# EAGLE design DS18B20_Modbus_v0.1 (EAGLE 7.7.0)
Assembly variants: default
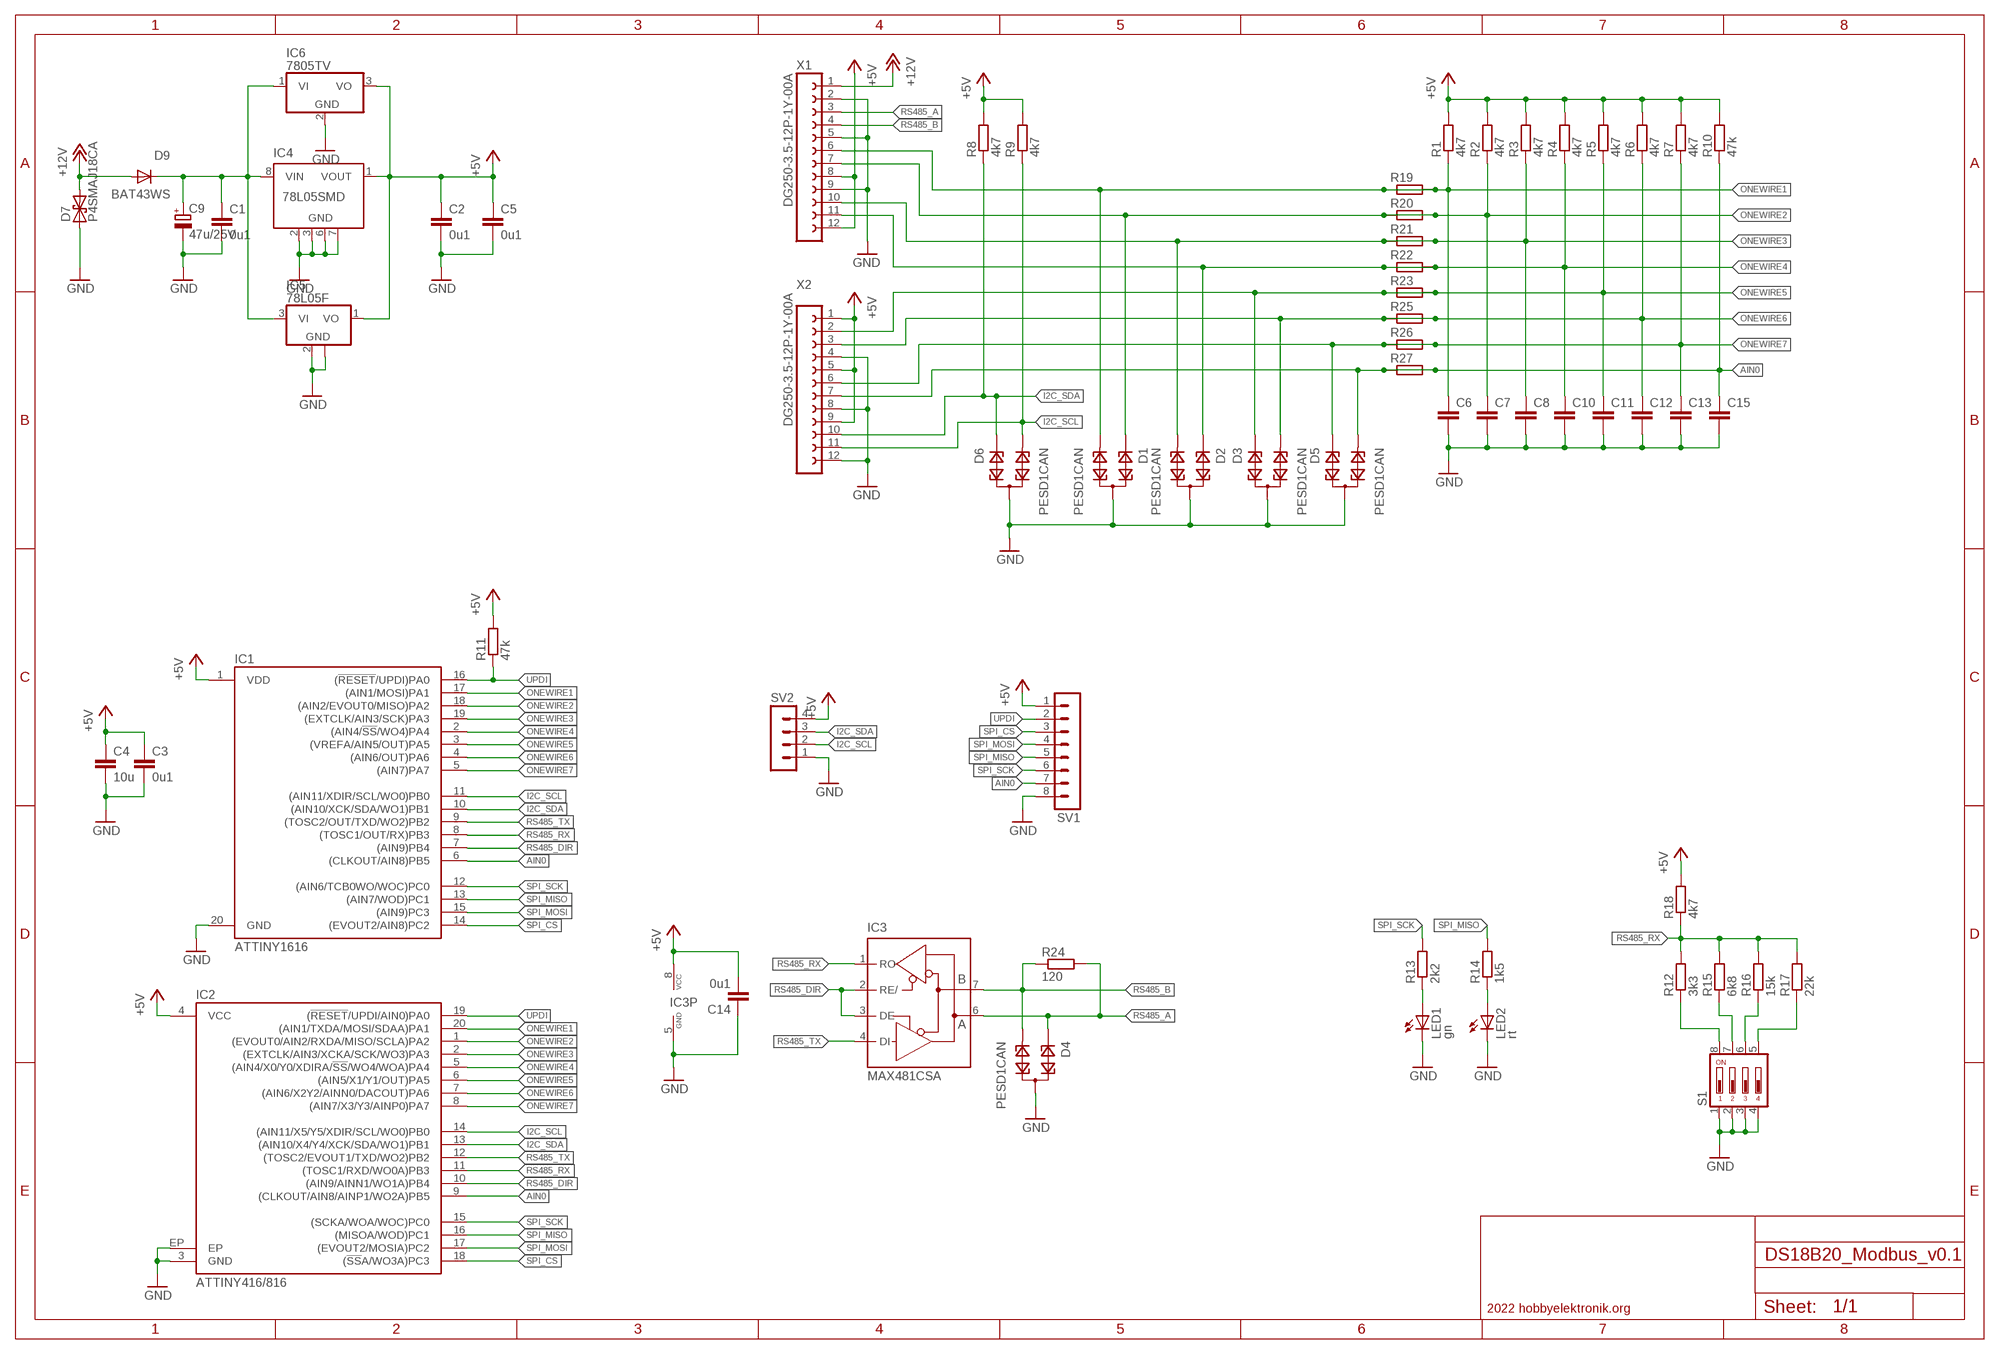
[diagram p0: schematic, sheet 1]

## Parts
C1  0u1  C-EUC0805  [C0805]
C2  0u1  C-EUC0603  [C0603]
C3  0u1  C-EUC0603  [C0603]
C4  10u  C-EUC0805  [C0805]
C5  0u1  C-EUC0603  [C0603]
C6  C-EUC0603  [C0603]  (not fitted in variant default)
C7  C-EUC0603  [C0603]  (not fitted in variant default)
C8  C-EUC0603  [C0603]  (not fitted in variant default)
C9  47u/25V  CPOL-EUE2.5-5  [E2,5-5]
C10  C-EUC0603  [C0603]  (not fitted in variant default)
C11  C-EUC0603  [C0603]  (not fitted in variant default)
C12  C-EUC0603  [C0603]  (not fitted in variant default)
C13  C-EUC0603  [C0603]  (not fitted in variant default)
C14  0u1  C-EUC0603  [C0603]
C15  C-EUC0603  [C0603]  (not fitted in variant default)
D1  PESD1CAN  [SOT23]
D2  PESD1CAN  [SOT23]
D3  PESD1CAN  [SOT23]
D4  PESD1CAN  [SOT23]
D5  PESD1CAN  [SOT23]
D6  PESD1CAN  [SOT23]
D7  P4SMAJ18CA  P4SMAJ10CA  [DO214AC]
D9  BAT43WS  DIODE-SOD323-W  [SOD323-W]
IC1  ATTINY1616  [SO20_T1616]
IC2  ATTINY416/816  [ZCL_VQFN-20]  (not fitted in variant default)
IC3  MAX481CSA  [SO08]
IC4  78L05SMD  [SO08]  (not fitted in variant default)
IC5  78L05F  [SOT89]
IC6  7805TV  [TO220V]  (not fitted in variant default)
LED1  gn  LEDSML0805  [SML0805]
LED2  rt  LEDSML0805  [SML0805]
R1  4k7  R-EU_R0603  [R0603]
R2  4k7  R-EU_R0603  [R0603]
R3  4k7  R-EU_R0603  [R0603]
R4  4k7  R-EU_R0603  [R0603]
R5  4k7  R-EU_R0603  [R0603]
R6  4k7  R-EU_R0603  [R0603]
R7  4k7  R-EU_R0603  [R0603]
R8  4k7  R-EU_R0603  [R0603]
R9  4k7  R-EU_R0603  [R0603]
R10  47k  R-EU_R0603  [R0603]
R11  47k  R-EU_R0603  [R0603]
R12  3k3  R-EU_R0603  [R0603]  (not fitted in variant default)
R13  2k2  R-EU_R0603  [R0603]
R14  1k5  R-EU_R0603  [R0603]
R15  6k8  R-EU_R0603  [R0603]  (not fitted in variant default)
R16  15k  R-EU_R0603  [R0603]  (not fitted in variant default)
R17  22k  R-EU_R0603  [R0603]  (not fitted in variant default)
R18  4k7  R-EU_R0603  [R0603]
R19  R-EU_R0603  [R0603]  (not fitted in variant default)
R20  R-EU_R0603  [R0603]  (not fitted in variant default)
R21  R-EU_R0603  [R0603]  (not fitted in variant default)
R22  R-EU_R0603  [R0603]  (not fitted in variant default)
R23  R-EU_R0603  [R0603]  (not fitted in variant default)
R24  120  R-EU_R0603  [R0603]
R25  R-EU_R0603  [R0603]  (not fitted in variant default)
R26  R-EU_R0603  [R0603]  (not fitted in variant default)
R27  R-EU_R0603  [R0603]  (not fitted in variant default)
S1  DS04  [DS-04]  (not fitted in variant default)
SV1  MA08-1R  [MA08-1R]
SV2  MA04-1R  [MA04-1R]
X1  DG250-3.5-12P-1Y-00A  [DG250-3.5-12P-1Y-00A]
X2  DG250-3.5-12P-1Y-00A  [DG250-3.5-12P-1Y-00A]

## Nets
+5V: C2.1 C3.1 C4.1 C5.1 C14.2 IC1.1(VDD) IC2.4(VCC) IC3.8(VCC) IC4.1(VOUT) IC5.1(VO) IC6.3(VO) R1.2 R2.2 R3.2 R4.2 R5.2 R6.2 R7.2 R8.2 R9.2 R10.2 R11.2 R18.2 SV1.1 SV2.4 X1.8 X1.12 X2.1 X2.5 X2.9
+12V: D7.2 D9.A X1.1
AIN0: C15.1 D5.2 IC1.6((CLKOUT/AIN8)PB5) IC2.9((CLKOUT/AIN8/AINP1/WO2A)PB5) R10.1 R27.1 R27.2 SV1.7 X2.7
GND: C1.2 C2.2 C3.2 C4.2 C5.2 C6.2 C7.2 C8.2 C9.- C10.2 C11.2 C12.2 C13.2 C14.1 C15.2 D1.3 D2.3 D3.3 D4.3 D5.3 D6.3 D7.1 IC1.20(GND) IC2.3(GND) IC2.EP IC3.5(GND) IC4.2(GND) IC4.3(GND) IC4.6(GND) IC4.7(GND) IC5.2(GND) IC5.2@1(GND) IC6.2(GND) LED1.C LED2.C S1.1 S1.2 S1.3 S1.4 SV1.8 SV2.1 X1.2 X1.5 X1.9 X2.4 X2.8 X2.12
I2C_SCL: D6.2 IC1.11((AIN11/XDIR/SCL/WO0)PB0) IC2.14((AIN11/X5/Y5/XDIR/SCL/WO0)PB0) R9.1 SV2.2 X2.11
I2C_SDA: D6.1 IC1.10((AIN10/XCK/SDA/WO1)PB1) IC2.13((AIN10/X4/Y4/XCK/SDA/WO1)PB1) R8.1 SV2.3 X2.10
N$2: R12.1 S1.8
N$3: R15.1 S1.7
N$4: R16.1 S1.6
N$5: R17.1 S1.5
N$6: LED1.A R13.1
N$7: LED2.A R14.1
N$9: C1.1 C9.+ D9.C IC4.8(VIN) IC5.3(VI) IC6.1(VI)
ONEWIRE1: C6.1 D1.2 IC1.17((AIN1/MOSI)PA1) IC2.20((AIN1/TXDA/MOSI/SDAA)PA1) R1.1 R19.1 R19.2 X1.6
ONEWIRE2: C7.1 D1.1 IC1.18((AIN2/EVOUT0/MISO)PA2) IC2.1((EVOUT0/AIN2/RXDA/MISO/SCLA)PA2) R2.1 R20.1 R20.2 X1.7
ONEWIRE3: C8.1 D2.2 IC1.19((EXTCLK/AIN3/SCK)PA3) IC2.2((EXTCLK/AIN3/XCKA/SCK/WO3)PA3) R3.1 R21.1 R21.2 X1.10
ONEWIRE4: C10.1 D2.1 IC1.2((AIN4/!SS!/WO4)PA4) IC2.5((AIN4/X0/Y0/XDIRA/!SS!/WO4/WOA)PA4) R4.1 R22.1 R22.2 X1.11
ONEWIRE5: C11.1 D3.1 IC1.3((VREFA/AIN5/OUT)PA5) IC2.6((AIN5/X1/Y1/OUT)PA5) R5.1 R23.1 R23.2 X2.2
ONEWIRE6: C12.1 D3.2 IC1.4((AIN6/OUT)PA6) IC2.7((AIN6/X2Y2/AINN0/DACOUT)PA6) R6.1 R25.1 R25.2 X2.3
ONEWIRE7: C13.1 D5.1 IC1.5((AIN7)PA7) IC2.8((AIN7/X3/Y3/AINP0)PA7) R7.1 R26.1 R26.2 X2.6
RS485_A: D4.1 IC3.6(A) R24.2 X1.3
RS485_B: D4.2 IC3.7(B) R24.1 X1.4
RS485_DIR: IC1.7((AIN9)PB4) IC2.10((AIN9/AINN1/WO1A)PB4) IC3.2(RE/) IC3.3(DE)
RS485_RX: IC1.8((TOSC1/OUT/RX)PB3) IC2.11((TOSC1/RXD/WO0A)PB3) IC3.1(RO) R12.2 R15.2 R16.2 R17.2 R18.1
RS485_TX: IC1.9((TOSC2/OUT/TXD/WO2)PB2) IC2.12((TOSC2/EVOUT1/TXD/WO2)PB2) IC3.4(DI)
SPI_CS: IC1.14((EVOUT2/AIN8)PC2) IC2.18((!SS!A/WO3A)PC3) SV1.3
SPI_MISO: IC1.13((AIN7/WOD)PC1) IC2.16((MISOA/WOD)PC1) R14.2 SV1.5
SPI_MOSI: IC1.15((AIN9)PC3) IC2.17((EVOUT2/MOSIA)PC2) SV1.4
SPI_SCK: IC1.12((AIN6/TCB0WO/WOC)PC0) IC2.15((SCKA/WOA/WOC)PC0) R13.2 SV1.6
UPDI: IC1.16((!RESET!/UPDI)PA0) IC2.19((!RESET!/UPDI/AIN0)PA0) R11.1 SV1.2
Unconnected: IC4.4(NC) IC4.5(NC)

## Notes on the sheet
- 2022 hobbyelektronik.org

## Library data of the parts
C1 = rcl:C-EU: CAPACITOR, European symbol; OC_REICHELT: KEM X7R0805 100N
C2 C3 C5 C14 = rcl:C-EU: CAPACITOR, European symbol; OC_REICHELT: KEM Y5V0603 100N
C4 = rcl:C-EU: CAPACITOR, European symbol; OC_REICHELT: KEM X5R0805 10U
C6-C8 C10-C13 C15 = rcl:C-EU: CAPACITOR, European symbol
C9 = rcl:CPOL-EU: POLARIZED CAPACITOR, European symbol; OC_REICHELT: HD-A 47U 25
D1-D6 = diode:PESD1CAN: CAN bus ESD protection diode Source: http://www.nxp.com/documents/data_sheet/PESD1CAN.pdf; OC_REICHELT: PESD 1CAN
D7 = diode-diotec:P4SMAJ; OC_REICHELT: P4SMAJ18CA
D9 = diode:DIODE-: DIODE; OC_REICHELT: BAT 43WS
IC1 = avr-7:ATTINY1616; OC_REICHELT: ATTINY1616-SN
IC2 = avr-7:ATTINY416/816
IC3 = maxim:MAX481CSA: RS485 TRANSEIVER; MF: MAXIM; MPN: MAX481CSA; OC_FARNELL: unknown; OC_NEWARK: 90C3817; OC_REICHELT: MAX 481 CSA
IC4 = linear:78L*SMD: Positive VOLTAGE REGULATOR
IC5 = linear:78L*: POSITOIV-VOLTAGE REGULATORS Output up to 100 mA Source: Datasheet <http://focus.ti.com/lit/ds/symlink/ua78l05.pdf>; OC_REICHELT: TS 78L05 ACY
IC6 = linear:78*: Positive VOLTAGE REGULATOR Source: http://cache.national.com/ds/LM/LM78L05.pdf http://www.fairchildsemi.com/ds/LM/LM7805.pdf
LED1 = led:LED: LED OSRAM: - CHIPLED LG R971, LG N971, LY N971, LG Q971, LY Q971, LO R971, LY R971 LH N974, LH R974 LS Q976, LO Q976, LY Q976 LO Q996 - Hyper CHIPLED LW Q18S LB Q993, LB Q99A, LB R99A - SideLED LS A670, LO A670, LY A670, LG A670, LP A670 LB A673, LV A673, LT A673, LW A673 LH A674 LY A675 LS A676, LA A676, LO A676, LY A676, LW A676 LS A679, LY A679, LG A679 - Hyper Micro SIDELED® LS Y876, LA Y876, LO Y876, LY Y876 LT Y87S - SmartLED LW L88C, LW L88S LB L89C, LB L89S, LG L890 LS L89K, LO L89K, LY L89K LS L896, LA L896, LO L896, LY L896 - TOPLED LS T670, LO T670, LY T670, LG T670, LP T670 LSG T670, LSP T670, LSY T670, LOP T670, LYG T670 LG T671, LOG T671, LSG T671 LB T673, LV T673, LT T673, LW T673 LH T674 LS T676, LA T676, LO T676, LY T676, LB T676, LH T676, LSB T676, LW T676 LB T67C, LV T67C, LT T67C, LS T67K, LO T67K, LY T67K, LW E67C LS E67B, LA E67B, LO E67B, LY E67B, LB E67C, LV E67C, LT E67C LW T67C LS T679, LY T679, LG T679 LS T770, LO T770, LY T770, LG T770, LP T770 LB T773, LV T773, LT T773, LW T773 LH T774 LS E675, LA E675, LY E675, LS T675 LS T776, LA T776, LO T776, LY T776, LB T776 LHGB T686 LT T68C, LB T68C - Hyper Mini TOPLED® LB M676 - Mini TOPLED Santana® LG M470 LS M47K, LO M47K, LY M47K Source: http://www.osram.convergy.de LUXEON: - LUMILED® LXK2-PW12-R00, LXK2-PW12-S00, LXK2-PW14-U00, LXK2-PW14-V00 LXK2-PM12-R00, LXK2-PM12-S00, LXK2-PM14-U00 LXK2-PE12-Q00, LXK2-PE12-R00, LXK2-PE12-S00, LXK2-PE14-T00, LXK2-PE14-U00 LXK2-PB12-K00, LXK2-PB12-L00, LXK2-PB12-M00, LXK2-PB14-N00, LXK2-PB14-P00, LXK2-PB14-Q00 LXK2-PR12-L00, LXK2-PR12-M00, LXK2-PR14-Q00, LXK2-PR14-R00 LXK2-PD12-Q00, LXK2-PD12-R00, LXK2-PD12-S00 LXK2-PH12-R00, LXK2-PH12-S00 LXK2-PL12-P00, LXK2-PL12-Q00, LXK2-PL12-R00 Source: www.luxeon.com KINGBRIGHT: KA-3528ASYC Source: www.kingbright.com; OC_REICHELT: SMD-LED 0805 GN
LED2 = led:LED: LED OSRAM: - CHIPLED LG R971, LG N971, LY N971, LG Q971, LY Q971, LO R971, LY R971 LH N974, LH R974 LS Q976, LO Q976, LY Q976 LO Q996 - Hyper CHIPLED LW Q18S LB Q993, LB Q99A, LB R99A - SideLED LS A670, LO A670, LY A670, LG A670, LP A670 LB A673, LV A673, LT A673, LW A673 LH A674 LY A675 LS A676, LA A676, LO A676, LY A676, LW A676 LS A679, LY A679, LG A679 - Hyper Micro SIDELED® LS Y876, LA Y876, LO Y876, LY Y876 LT Y87S - SmartLED LW L88C, LW L88S LB L89C, LB L89S, LG L890 LS L89K, LO L89K, LY L89K LS L896, LA L896, LO L896, LY L896 - TOPLED LS T670, LO T670, LY T670, LG T670, LP T670 LSG T670, LSP T670, LSY T670, LOP T670, LYG T670 LG T671, LOG T671, LSG T671 LB T673, LV T673, LT T673, LW T673 LH T674 LS T676, LA T676, LO T676, LY T676, LB T676, LH T676, LSB T676, LW T676 LB T67C, LV T67C, LT T67C, LS T67K, LO T67K, LY T67K, LW E67C LS E67B, LA E67B, LO E67B, LY E67B, LB E67C, LV E67C, LT E67C LW T67C LS T679, LY T679, LG T679 LS T770, LO T770, LY T770, LG T770, LP T770 LB T773, LV T773, LT T773, LW T773 LH T774 LS E675, LA E675, LY E675, LS T675 LS T776, LA T776, LO T776, LY T776, LB T776 LHGB T686 LT T68C, LB T68C - Hyper Mini TOPLED® LB M676 - Mini TOPLED Santana® LG M470 LS M47K, LO M47K, LY M47K Source: http://www.osram.convergy.de LUXEON: - LUMILED® LXK2-PW12-R00, LXK2-PW12-S00, LXK2-PW14-U00, LXK2-PW14-V00 LXK2-PM12-R00, LXK2-PM12-S00, LXK2-PM14-U00 LXK2-PE12-Q00, LXK2-PE12-R00, LXK2-PE12-S00, LXK2-PE14-T00, LXK2-PE14-U00 LXK2-PB12-K00, LXK2-PB12-L00, LXK2-PB12-M00, LXK2-PB14-N00, LXK2-PB14-P00, LXK2-PB14-Q00 LXK2-PR12-L00, LXK2-PR12-M00, LXK2-PR14-Q00, LXK2-PR14-R00 LXK2-PD12-Q00, LXK2-PD12-R00, LXK2-PD12-S00 LXK2-PH12-R00, LXK2-PH12-S00 LXK2-PL12-P00, LXK2-PL12-Q00, LXK2-PL12-R00 Source: www.luxeon.com KINGBRIGHT: KA-3528ASYC Source: www.kingbright.com; OC_REICHELT: SMD-LED 0805 RT
R1-R8 R18 = rcl:R-EU_: RESISTOR, European symbol; OC_REICHELT: SMD-0603 4,7K
R9-R11 = rcl:R-EU_: RESISTOR, European symbol; OC_REICHELT: SMD-0603 47K
R12 R15-R17 R19-R23 R25-R27 = rcl:R-EU_: RESISTOR, European symbol
R13 = rcl:R-EU_: RESISTOR, European symbol; OC_REICHELT: SMD-0603 2,2K
R14 = rcl:R-EU_: RESISTOR, European symbol; OC_REICHELT: SMD-0603 1,5K
R24 = rcl:R-EU_: RESISTOR, European symbol; OC_REICHELT: RND 155HP03 AL
S1 = switch-dil:DS04: DIL/CODE SWITCH; OC_FARNELL: 9471570; OC_NEWARK: unknown
SV1 = con-lstb:MA08-1: PIN HEADER; OC_REICHELT: MPE 087-1-008
SV2 = con-lstb:MA04-1: PIN HEADER; OC_REICHELT: MPE 087-1-004
X1 X2 = con-degson:DG250-3.5-12P-1Y-00A; OC_REICHELT: DG250 3,5-12

## Board
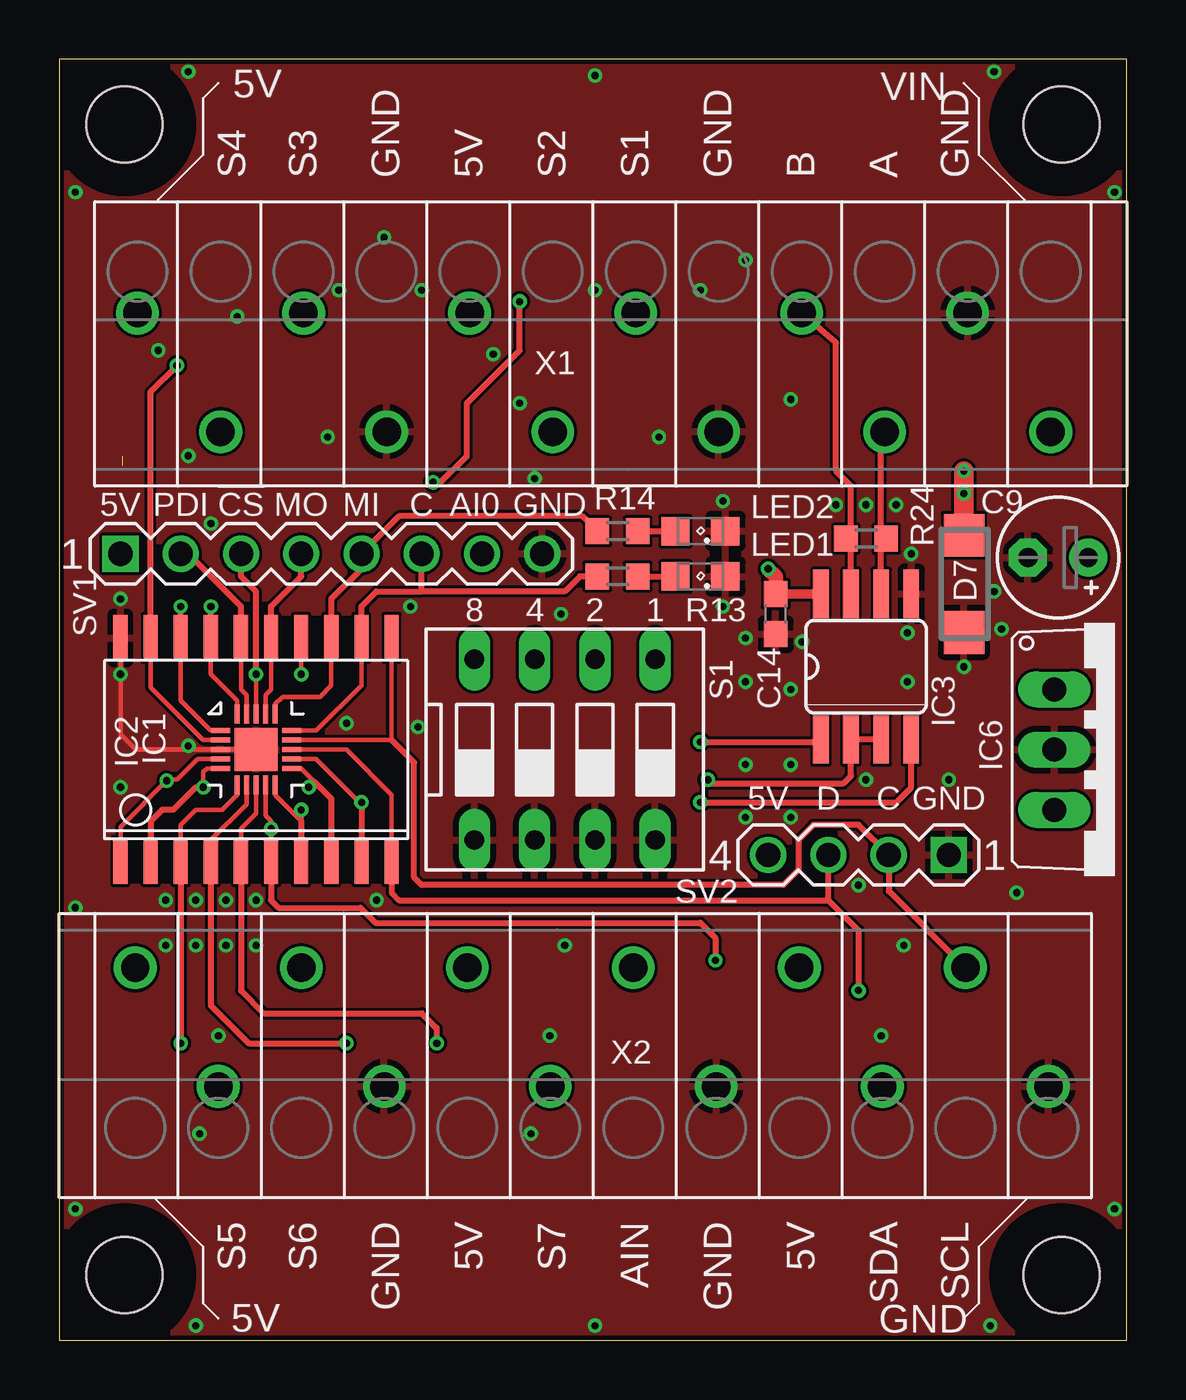
[diagram p1: board, top side]
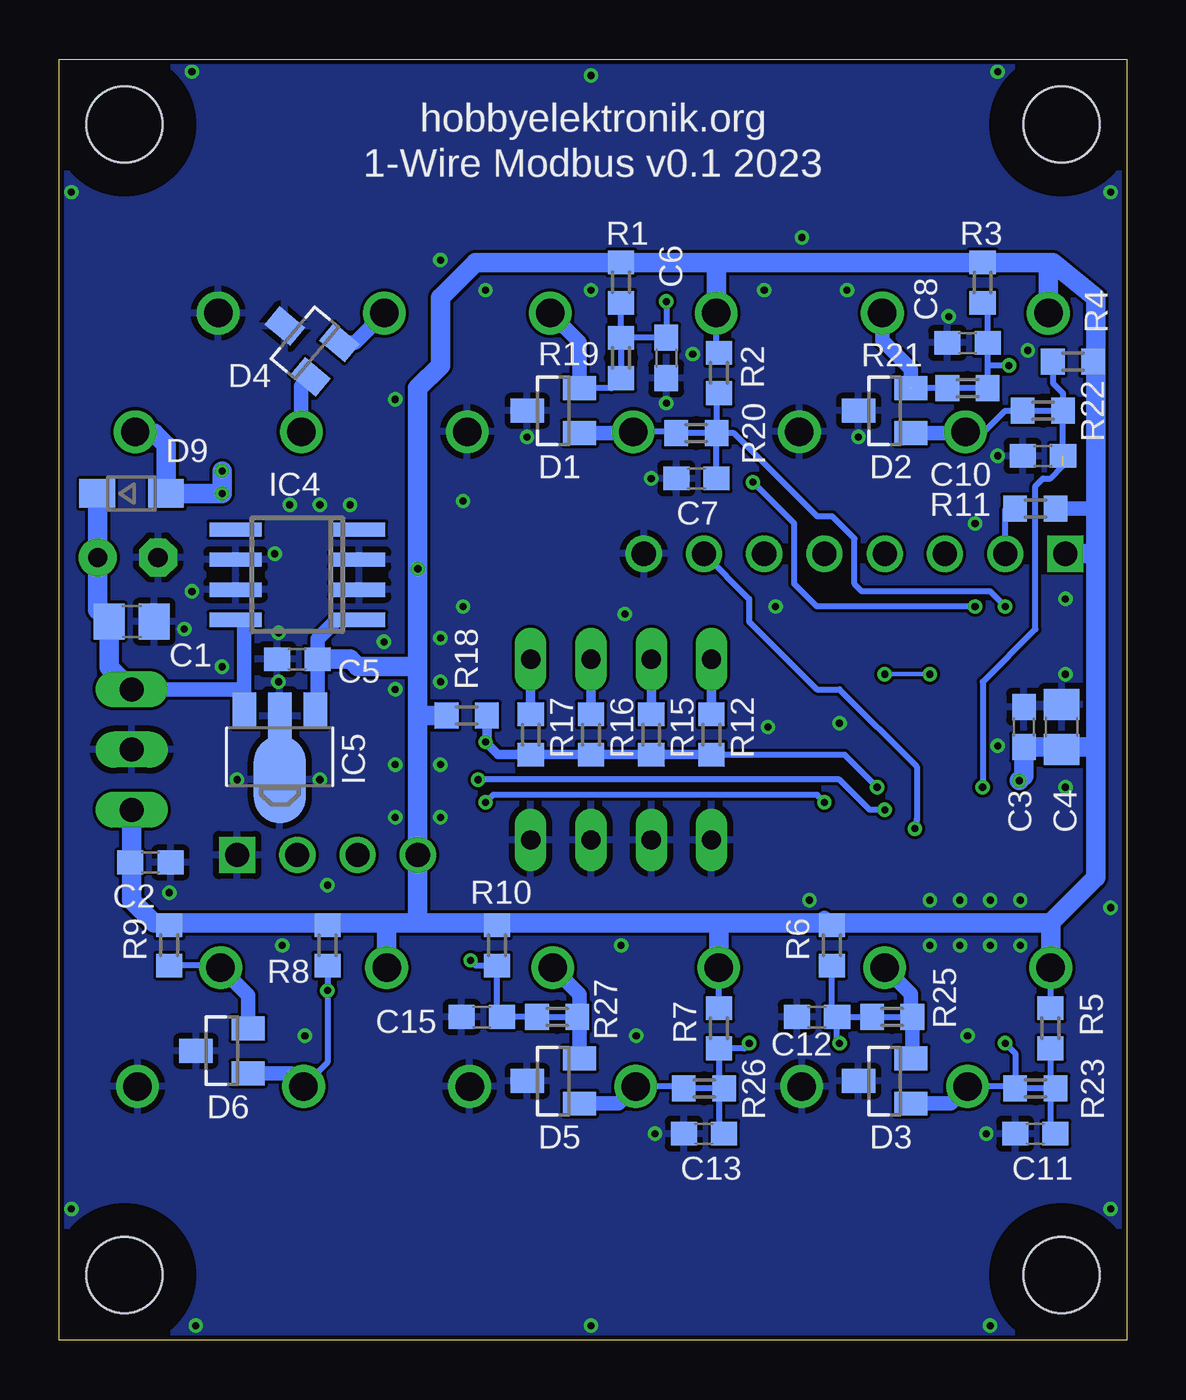
[diagram p2: board, bottom side, seen from below]

Size 45 x 54 mm. Coordinates in mm from the lower left corner, seen from the top.
Outline: 0,0 45,0 45,54 0,54 0,0
Copper layers (1*16): Top 0.035mm / dielectric 1.5mm / Bottom 0.035mm
Design rules "jlcpcb_2L": minimum track width 5mil, minimum drill 0.3mm, track to track 5mil, track to pad 5mil, pad to pad 0.2mm, via to via 0.25mm, smd to smd 0mil, copper to edge 0.2mm, drill to drill 0.5mm, minimum pad ring 10mil, minimum via ring 6mil, stop-mask expansion 2mil, vias tented up to drill 25mil, thermal gap 10mil
Holes 3.2 mm at 42.25,2.75 2.75,2.75 42.25,51.25 2.75,51.25
tRestrict: area 0,0 to 5.5,5.5; area 0,48.5 to 5.5,54; area 39.5,48.5 to 45,54; area 39.5,0 to 45,5.5; 12 lines
bRestrict: area 0,48.5 to 5.5,54; area 39.5,48.5 to 45,54; area 39.5,0 to 45,5.5; area 0,0 to 5.5,5.5; 16 lines

### Footprints (pad centres in the part's own frame; a part is rotated, then mirrored left to right if it is on the bottom)
C0805 = smd 1.3 x 1.5: 1 -0.95,0; 2 0.95,0
C0603 = smd 1.1 x 1: 1 -0.85,0; 2 0.85,0
E2,5-5 = drill 0.813 pad 1.6: + -1.27,0 | drill 0.813 pad 1.6 octagon: - 1.27,0
SOT23 = smd 1 x 1.4: 1 -0.95,-1.1; 2 0.95,-1.1; 3 0,1.1
DO214AC = smd 1.8 x 1.7: 1 2.05,0; 2 -2.05,0
SOD323-W = smd 1.5 x 1.2: A 1.45,0; C -1.45,0
SO20_T1616 = smd 0.6 x 1.95: 1 -5.715,-4.7; 2 -4.445,-4.7; 3 -3.175,-4.7; 4 -1.905,-4.7; 5 -0.635,-4.7; 6 0.635,-4.7; 7 1.905,-4.7; 8 3.175,-4.7; 9 4.445,-4.7; 10 5.715,-4.7; 11 5.715,4.7; 12 4.445,4.7; 13 3.175,4.7; 14 1.905,4.7; 15 0.635,4.7; 16 -0.635,4.7; 17 -1.905,4.7; 18 -3.175,4.7; 19 -4.445,4.7; 20 -5.715,4.7
ZCL_VQFN-20 = smd 0.8 x 0.2: 1 -1.5,0.8; 2 -1.5,0.4; 3 -1.5,0; 4 -1.5,-0.4; 5 -1.5,-0.8; 11 1.5,-0.8; 12 1.5,-0.4; 13 1.5,0; 14 1.5,0.4; 15 1.5,0.8 | smd 0.2 x 0.8: 6 -0.8,-1.5; 7 -0.4,-1.5; 8 0,-1.5; 9 0.4,-1.5; 10 0.8,-1.5; 16 0.8,1.5; 17 0.4,1.5; 18 0,1.5; 19 -0.4,1.5; 20 -0.8,1.5 | smd 1.8 x 1.8: EP 0,0
SO08 = smd 0.66 x 2.032: 1 -1.905,-3.073; 2 -0.635,-3.073; 3 0.635,-3.073; 4 1.905,-3.073; 5 1.905,3.073; 6 0.635,3.073; 7 -0.635,3.073; 8 -1.905,3.073
SO08' = smd 0.6 x 2.2: 1 -1.905,-2.6; 2 -0.635,-2.6; 3 0.635,-2.6; 4 1.905,-2.6; 5 1.905,2.6; 6 0.635,2.6; 7 -0.635,2.6; 8 -1.905,2.6
SOT89 = smd 1 x 1.5: 1 -1.499,-1.981; 3 1.499,-1.981 | smd 1 x 2: 2 0,-1.727 | smd 2.2 x 3.7: 2@1 0,0.94
TO220V = drill 1.016 long: 1 -2.54,-2.54; 2 0,-2.54; 3 2.54,-2.54
SML0805 = smd 1.2 x 1.2: A 1.05,0; C -1.05,0
R0603 = smd 1 x 1.1: 1 -0.85,0; 2 0.85,0
DS-04 = drill 0.813 long: 1 -3.81,-3.81; 2 -1.27,-3.81; 3 1.27,-3.81; 4 3.81,-3.81; 5 3.81,3.81; 6 1.27,3.81; 7 -1.27,3.81; 8 -3.81,3.81
MA08-1R = drill 1.016 square: 1 -8.89,0 | drill 1.016: 2 -6.35,0; 3 -3.81,0; 4 -1.27,0; 5 1.27,0; 6 3.81,0; 7 6.35,0; 8 8.89,0
MA04-1R = drill 1.016 square: 1 -3.81,0 | drill 1.016: 2 -1.27,0; 3 1.27,0; 4 3.81,0
DG250-3.5-12P-1Y-00A = drill 1.2: 1 -19.3,3.7; 2 -15.8,-1.3; 3 -12.3,3.7; 4 -8.8,-1.3; 5 -5.3,3.7; 6 -1.8,-1.3; 7 1.7,3.7; 8 5.2,-1.3; 9 8.7,3.7; 10 12.2,-1.3; 11 15.7,3.7; 12 19.2,-1.3

### Placement (x,y rotation side)
C1  41.95,30.3 0 bottom
C2  41.16,20.14 0 bottom
C3  4.33,25.85 90 bottom
C4  2.74,25.85 90 bottom
C5  34.97,28.71 180 bottom
C6  19.41,41.41 270 bottom  (not fitted)
C7  18.14,36.33 180 bottom  (not fitted)
C8  6.71,42.05 180 bottom  (not fitted)
C9  42.11,33 180 top
C10  3.53,37.28 180 bottom  (not fitted)
C11  3.85,8.71 180 bottom  (not fitted)
C12  13.06,13.63 180 bottom  (not fitted)
C13  17.82,8.71 180 bottom  (not fitted)
C14  30.2,30.61 90 top
C15  27.19,13.63 180 bottom  (not fitted)
D1  24.17,39.19 90 bottom
D2  10.2,39.19 90 bottom
D3  10.2,10.93 90 bottom
D4  34.65,42.05 50 bottom
D5  24.17,10.93 90 bottom
D6  38.14,12.2 90 bottom
D7  38.14,31.88 270 top
D9  41.95,35.7 0 bottom
IC1  8.29,24.9 0 top
IC2  8.29,24.9 0 top  (not fitted)
IC3  34.01,28.39 0 top
IC4  78L05SMD  [SO08']  34.96,32.27 90 bottom  (not fitted)
IC5  35.7,24.59 180 bottom
IC6  44.49,24.9 270 top  (not fitted)
LED1  27.03,32.2 180 top
LED2  27.03,34.11 180 top
R1  21.31,44.59 90 bottom
R2  17.18,40.77 90 bottom
R3  6.07,44.59 90 bottom
R4  2.26,41.25 0 bottom
R5  3.21,13.15 90 bottom
R6  12.42,16.64 90 bottom
R7  17.18,13.15 90 bottom
R8  33.7,16.64 90 bottom
R9  40.36,16.64 90 bottom
R10  26.55,16.64 90 bottom
R11  3.85,35.06 0 bottom
R12  17.5,25.54 270 bottom  (not fitted)
R13  23.54,32.2 180 top
R14  23.54,34.11 180 top
R15  20.04,25.54 270 bottom  (not fitted)
R16  22.58,25.54 270 bottom  (not fitted)
R17  25.12,25.54 270 bottom  (not fitted)
R18  27.82,26.33 180 bottom
R19  21.31,41.41 90 bottom  (not fitted)
R20  18.14,38.23 0 bottom  (not fitted)
R21  6.71,40.14 0 bottom  (not fitted)
R22  3.53,39.19 0 bottom  (not fitted)
R23  3.85,10.61 0 bottom  (not fitted)
R24  34.01,33.79 0 top
R25  9.88,13.63 180 bottom  (not fitted)
R26  17.82,10.61 0 bottom  (not fitted)
R27  24.01,13.63 180 bottom  (not fitted)
S1  21.31,24.9 0 top  (not fitted)
SV1  11.47,33.16 0 top
SV2  33.7,20.45 180 top
X1  22.5,42 180 top
X2  22.5,12 0 top

### Tracks (layer width: path | path; a pad name or v marks a point on that pad's centre or on a via)
+5V  (via drill 0.3)
  Top 0.2: IC1.1 2.58,21.64 v4.53,23.59 4.57,23.63 4.96,23.63 5.83,24.5 IC2.4
  Top 0.406: IC3.8 C14.2
  Top 0.61: C14.2 30.2,32.2 v29.88,32.52
  Bottom 0.254: 17.18,15.71 X2.5 17.18,15.68 R7.2 | C2.1 42.01,20.4 41.95,20.45 | R2.2 17.3,41.67 X1.8 | X2.1 3.21,15.68 R5.2 | R8.2 33.7,17.6
  Bottom 0.406: 29.78,31.47 29.88,31.57 v29.88,32.52
  Bottom 0.61: IC4.1 33.31,30.37 34.12,29.56 C5.1 34.12,26.65 IC5.1 | R11.2 1.31,35.06 | R6.2 12.74,17.81 12.74,17.6 | R9.2 40.68,17.5 40.68,17.6 | R10.2 26.39,17.6
  Bottom 0.813: X2.9 31.2,17.6 | 31.2,17.6 33.7,17.6 40.68,17.6 41,17.6 41.95,18.55 41.95,20.45 IC6.3 | 31.2,17.6 29.88,17.6 | 29.88,17.6 26.39,17.6 17.18,17.6 | 17.18,17.6 12.74,17.6 3.21,17.6 | 29.88,17.6 SV2.4 29.88,26.17 | 17.18,15.71 17.18,17.6 | X2.1 3.2,17.6 3.21,17.6 | 1.31,41.41 1.31,43.95 3.11,45.44 3.3,45.44 | 1.31,41.41 1.31,35.06 1.31,33.16 | 1.31,33.16 1.31,25.22 | 1.31,25.22 1.31,19.5 3.21,17.6 | X1.12 3.3,45.44 | X1.8 17.3,45.44 | 29.88,26.17 29.88,28.39 | 29.88,28.39 29.88,31.57 29.88,40.14 28.93,41.09 28.93,43.95 27.45,45.44 R1.2 17.3,45.44 | SV1.1 1.31,33.16 | 2.9,25 C3.1 4.33,23.79 v4.53,23.59 | 2.9,25 1.53,25 1.31,25.22 | C4.1 2.9,25 | R18.2 29.73,26.33 29.88,26.17 | R4.2 1.41,41.31 1.31,41.41 | 17.3,45.44 R3.2 3.3,45.44 | C5.1 32.74,28.71 32.42,28.39 29.88,28.39
+12V  (via drill 0.3)
  Top 0.813: D7.2 v38.14,36.65
  Bottom 0.813: X1.1 41.73,38.23 41,38.23 40.5,37.74 D9.A v38.14,35.7 v38.14,36.65
AIN0  (via drill 0.3)
  Top 0.2: IC2.9 8.7,22.12 8.93,21.88 v8.93,21.57 IC1.6
  Top 0.254: IC1.6 8.93,18.55 9.25,18.23 12.69,18.23 13.33,17.6 27.03,17.6 27.66,16.96 v27.66,16.01
  Bottom 0.254: v8.93,21.57 8.85,21.96 8.85,24.19 12.11,27.44 13.06,27.44 15.91,30.3 15.91,31.25 SV1.7 | v27.66,16.01 27.45,15.8 R10.1 26.55,13.84 C15.1 R27.2 R27.1 23.07,13.72 23.07,13.79
  Bottom 0.61: X2.7 23.07,14.57 23.07,13.79 | R27.1 23.07,13.54 D5.2
GND  (via drill 0.3)
  Top 0.2: IC1.20 v2.58,28.07 2.58,25.54 3.21,24.9 IC2.3 IC2.EP
  other vias: 0.67,18.23 12.11,26.01 2.58,31.25 27.98,35.38 27.98,30.93 35.92,33.16 30.84,27.44 13.38,18.55 8.29,18.55 5.76,18.55 15.12,25.85 11.31,38.08 5.44,53.48 39.41,53.48 44.49,48.4 44.49,5.53 39.25,0.61 5.76,0.61 0.67,5.53 22.58,0.61 22.58,53.32 15.28,44.27 13.69,46.49 28.93,45.54 27.03,44.27 30.84,24.27 30.84,22.04 28.93,24.27 28.93,27.76 28.93,22.04 20.68,12.84 35.6,16.64 40.36,18.87 39.41,31.57 30.84,39.66 31.31,29.44 35.76,29.82 37.51,23.63 34.01,23.63 21.15,30.61 14.8,30.93 4.49,18.55 4.49,16.64 2.58,23.31 0.67,48.4 21.31,16.64 6.39,34.42 33.7,19.18 19.41,39.51 7.5,43.16 5.44,37.28 7.03,18.55 7.03,16.64 4.17,41.73 18.3,41.57 22.58,44.27 11.79,44.27 25.28,38.08 20.04,36.33 35.76,27.76 6.71,12.84 34.65,12.84 8.29,16.64 5.76,16.64 34.01,35.22 32.74,35.22 35.28,35.22 28.93,29.6 5.44,25.06 5.91,8.71 19.88,8.71 38.14,28.39 39.73,29.98
  pour Bottom (isolate 0.127): -0.5,54 45.5,54 45.5,0 -0.5,0
  pour Top (isolate 0.127): 45.5,54 -0.5,54 -0.5,0 45.5,0
I2C_SCL
  Top 0.2: IC2.14 14.01,25.3 IC1.11
  Top 0.254: X2.11 34.97,18.93 SV2.2 33.7,21.73 31.79,21.73 31.16,21.09 31.16,19.82 30.52,19.18 15.28,19.18 14.96,19.5 14.96,24.35 14.01,25.3
  Bottom 0.254: X2.11 38.3,15.8 R9.1
  Bottom 0.61: X2.11 37.04,14.54 D6.2
I2C_SDA  (via drill 0.3)
  Top 0.2: IC2.13 12.11,24.9 14.01,23 IC1.10
  Top 0.254: IC1.10 14.01,18.87 14.33,18.55 32.42,18.55 | 32.42,18.55 SV2.3 | 32.42,18.55 33.7,17.28 v33.7,14.74
  Bottom 0.254: R8.1 v33.7,14.74 33.7,11.71 X2.10
  Bottom 0.61: X2.10 35.25,11.25 D6.1
N$2
  Bottom 0.406: R12.1 S1.8
N$3
  Bottom 0.406: R15.1 S1.7
N$4
  Bottom 0.406: R16.1 S1.6
N$5
  Bottom 0.406: R17.1 S1.5
N$6
  Top 0.254: R13.1 LED1.A
N$7
  Top 0.254: R14.1 LED2.A
N$9
  Bottom 0.61: IC4.8 37.2,30.37 37.2,27.44 | 37.2,27.44 IC5.3 | IC6.1 37.2,27.44
  Bottom 0.813: D9.C 43.38,35.67 C9.+ 43.38,30.78 C1.1 42.9,28.39 IC6.1
ONEWIRE1  (via drill 0.3)
  Top 0.2: IC2.20 7.49,26.97 6.39,28.07 IC1.17
  Top 0.254: IC1.17 v6.39,30.93 | v15.76,36.17 16.07,36.17 17.18,37.28 17.18,39.51 19.41,41.73 v19.41,43.79
  Bottom 0.254: v6.39,30.93 13.06,30.93 14.01,31.88 14.01,34.42 v15.76,36.17 | D1.2 21.73,40.14 R19.1 R19.2 | R19.2 R1.1 | R19.2 C6.1 v19.41,43.79
  Bottom 0.61: X1.6 23.07,42.07 D1.2
ONEWIRE2  (via drill 0.3)
  Top 0.2: IC2.1 6.39,25.7 5.12,26.97 IC1.18
  Top 0.254: IC1.18 v5.12,30.93
  Bottom 0.254: v5.12,30.93 5.76,31.57 11.15,31.57 11.47,31.88 11.47,33.79 12.42,34.74 13.06,34.74 16.55,38.23 R20.2 | R2.1 17.29,39.87 R20.2 | C7.1 R20.2 | X1.7 19.05,38.3 R20.1 R20.2
  Bottom 0.61: X1.7 20.86,38.24 D1.1
ONEWIRE3  (via drill 0.3)  (1 unrouted)
  Top 0.2: IC2.2 6.07,25.3 3.85,27.52 IC1.19
  Top 0.254: IC1.19 3.85,39.98 v4.96,41.09
  Bottom 0.254: 5.86,41.09 R21.2 R21.1 D2.2 | 5.86,41.09 C8.1 5.86,43.52 R3.1 | v4.96,41.09 5.86,41.09
  Bottom 0.61: D2.2 9.1,40.94 10.3,42.15 X1.10
ONEWIRE4  (via drill 0.3)  (1 unrouted)
  Top 0.2: IC2.5 6.22,24.1 6.07,23.95 v6.07,23.31
  Top 0.254: IC1.2 3.85,21.88 4.33,22.36 4.8,22.36 5.76,23.31 v6.07,23.31
  Bottom 0.254: v6.07,23.31 6.07,27.76 3.85,29.98 3.85,36.01 3.53,36.33 3.21,36.33 2.68,36.86 | C10.1 R22.2 | R4.1 3.11,40.35 2.68,39.92 R22.2 | X1.11 6.01,38.3 5.12,39.19 R22.1 R22.2
  Bottom 0.61: X1.11 6.86,38.24 D2.1
ONEWIRE5  (via drill 0.3)
  Top 0.2: IC2.6 7.49,22.99 6.87,22.36 5.76,22.36 5.12,21.73 IC1.3
  Top 0.254: IC1.3 v5.12,12.52
  Bottom 0.254: v5.12,12.52 4.7,12.1 R23.1 | R5.1 3.21,10.61 | 3.21,10.61 3.21,8.92 C11.1 | R23.2 3.21,10.61 | 6.61,10.61 X2.2 4.79,10.7 R23.1 | 3.21,10.61 R23.1
  Bottom 0.61: X2.2 7.42,9.98 D3.1
ONEWIRE6  (via drill 0.3)
  Top 0.2: IC2.7 7.89,22.59 6.39,21.09 IC1.4
  Top 0.254: IC1.4 6.39,14.11 7.98,12.52 v12.11,12.52
  Bottom 0.254: C12.1 12.42,13.84 R6.1 | v12.11,12.52 12.21,12.62 C12.1 | 9.1,13.79 9.1,13.7 R25.1 R25.2 C12.1
  Bottom 0.61: X2.3 9.1,14.6 9.1,13.79 | D3.2 9.03,11.95 R25.1
ONEWIRE7  (via drill 0.3)
  Top 0.2: IC2.8 8.29,22.2 7.66,21.57 IC1.5
  Top 0.254: IC1.5 7.66,14.74 8.61,13.79 15.28,13.79 15.91,13.15 v15.91,12.52
  Bottom 0.254: 17.18,10.61 R7.1 16.13,12.3 v15.91,12.52 | R26.2 17.18,10.61 | 17.18,10.61 17.18,8.92 C13.1 | 20.61,10.61 X2.6 18.76,10.7 R26.1 17.18,10.61
  Bottom 0.61: X2.6 21.42,9.98 D5.1
RS485_A
  Top 0.254: IC3.6 34.65,34.11 | 34.65,34.11 34.65,38.13 X1.3 | R24.2 34.86,33.89 34.65,34.11
  Bottom 0.61: D4.1 34.8,40.23 X1.3
RS485_B
  Top 0.254: IC3.7 33.38,33.79 | 33.38,33.79 33.38,36.01 32.74,36.65 32.74,42.05 X1.4 | R24.1 33.38,33.79
  Bottom 0.61: D4.2 32.53,42.07 X1.4
RS485_DIR  (via drill 0.3)
  Top 0.2: IC2.10 9.1,22.99 10.2,21.88
  Top 0.254: IC1.7 10.2,21.88 v10.2,22.36 | IC3.3 IC3.2 33.38,23.79 33.06,23.47 27.5,23.47 v27.34,23.63
  Bottom 0.254: v10.2,22.36 10.84,22.36 12.11,23.63 v27.34,23.63
RS485_RX  (via drill 0.3)
  Top 0.2: IC2.11 10.2,24.1 10.75,23.55
  Top 0.254: IC1.8 11.47,22.83 10.75,23.55 v10.52,23.31 | v27.03,25.22 32.01,25.22 IC3.1
  Bottom 0.254: R12.2 11.89,24.68 v10.52,23.31
  Bottom 0.406: R12.2 R15.2 R16.2 R17.2 26.5,24.68 v27.03,25.22 26.97,25.27 R18.1
RS485_TX  (via drill 0.3)
  Top 0.2: IC2.12 10.84,24.5 12.74,22.59
  Top 0.254: IC1.9 12.74,22.59 v12.74,22.68 | v27.03,22.68 35.28,22.68 35.92,23.31 IC3.4
  Bottom 0.254: v12.74,22.68 13.06,23 26.71,23 v27.03,22.68
SPI_CS  (via drill 0.3)
  Top 0.2: IC2.18 v8.29,28.07 | v10.2,28.07 IC1.14
  Top 0.254: v8.29,28.07 8.29,31.57 7.66,32.2 SV1.3
  Bottom 0.2: v8.29,28.07 v10.2,28.07
SPI_MISO
  Top 0.2: IC2.16 9.1,26.81 9.41,27.12 10.99,27.12 11.47,27.6 IC1.13
  Top 0.254: IC1.13 11.47,31.25 12.74,32.52 SV1.5 14.33,34.74 22.05,34.74 R14.2
SPI_MOSI
  Top 0.2: IC2.17 8.7,27.2 8.93,27.44 IC1.15
  Top 0.254: IC1.15 8.93,30.93 10.2,32.2 SV1.4
SPI_SCK
  Top 0.2: IC2.15 10.84,25.7 12.74,27.61 IC1.12
  Top 0.254: IC1.12 12.74,30.93 13.38,31.57 15.28,31.57 | R13.2 21.95,32.2 21.31,31.57 15.28,31.57 | 15.28,31.57 SV1.6
UPDI
  Top 0.2: IC2.19 7.89,27.2 7.66,27.44 IC1.16
  Top 0.254: IC1.16 7.66,30.93 5.44,33.16 SV1.2
  Bottom 0.254: SV1.2 5.12,35 R11.1

### Text on the board
_tsilk: 5V | VIN | S4 | S3 | GND | 5V | S2 | S1 | GND | B | A | GND | 5V | PDI | !CS! | MO | MI | C | AI0 | GND | 8 | 4 | 2 | 1 | 5V | D | C | GND | S5 | S6 | GND | 5V | S7 | AIN | GND | 5V | SDA | SCL | 5V | GND
_bsilk: hobbyelektronik.org | 1-Wire Modbus v0.1 2023